# Altium project NANO_STM32F103.PrjPCB
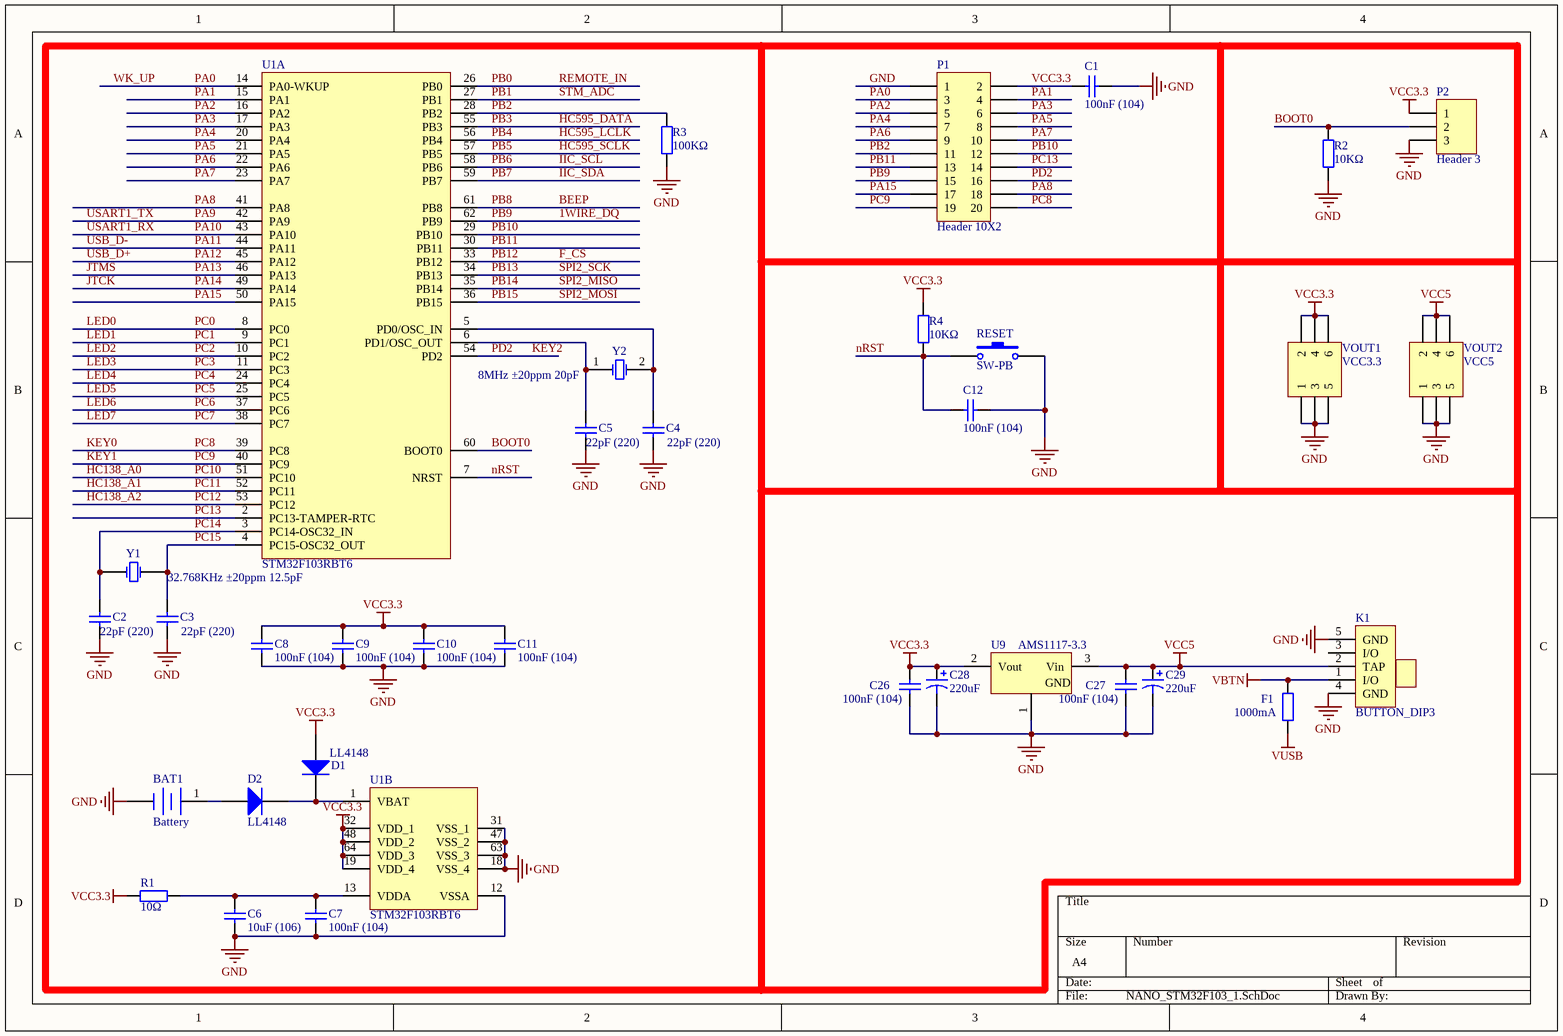
[diagram p0: NANO_STM32F103_1.SchDoc]
3 sheets, 129 parts. Net scope: global (net labels, ports and power ports of the same name join across sheets).
Board file: NANO_STM32F103.PcbDoc
Sheets:
  NANO_STM32F103_1.SchDoc
  NANO_STM32F103_2.SchDoc
  NANO_STM32F103_3.SchDoc

## Sheet NANO_STM32F103_1.SchDoc
size A4

### Parts
BAT1  Battery  [BAT-2]
C1  100nF (104)  [0603_C]
C2  22pF (220)  [0603_C]
C3  22pF (220)  [0603_C]
C4  22pF (220)  [0603_C]
C5  22pF (220)  [0603_C]
C6  10uF (106)  [0805_C]
C7  100nF (104)  [0603_C]
C8  100nF (104)  [0603_C]
C9  100nF (104)  [0603_C]
C10  100nF (104)  [0603_C]
C11  100nF (104)  [0603_C]
C12  100nF (104)  [0603_C]
C26  100nF (104)  [0603_C]
C27  100nF (104)  [0603_C]
C28  220uF  [RB7.6-15]
C29  220uF  [RB7.6-15]
D1  LL4148  [LL-34]
D2  LL4148  [LL-34]
F1  1000mA  [0805_R]
K1  BUTTON_DIP3  [SW]
P1  Header 10X2  [HDR2X10]
P2  Header 3  [HDR1X3]
R1  10Ω  [0603_R]
R2  10KΩ  [0603_R]
R3  100KΩ  [0603_R]
R4  10KΩ  [0603_R]
RESET  SW-PB  [SPST-2]
U1  STM32F103RBT6  [LQFP-64_10x10x05P]  (parts A,B of 2)
U9  AMS1117-3.3  [SOT-223]
VOUT1  VCC3.3  [HDR2X3]
VOUT2  VCC5  [HDR2X3]
Y1  32.768KHz ±20ppm 12.5pF  [SMD-3215_2P FC - 135]
Y2  8MHz ±20ppm 20pF  [SMD-5032_2P]

### Nets
GND: BAT1.2(-) C1.1 C2.2 C3.1 C4.1 C5.1 C6.2 C7.2 C8.1 C9.1 C10.1 C11.1 C12.1 C26.1 C27.1 C28.2 C29.2 K1.4(GND) K1.5(GND) P1.1 P2.3 R2.1 R3.1 RESET.2 U1.12(VSSA) U1.18(VSS_4) U1.31(VSS_1) U1.47(VSS_2) U1.63(VSS_3) U9.1(GND) VOUT1.1 VOUT1.3 VOUT1.5 VOUT2.1 VOUT2.3 VOUT2.5
VBTN: F1.2 K1.1(I/O)
VCC3.3: C1.2 C8.2 C9.2 C10.2 C11.2 C26.2 C28.1 D1.1(A) P1.2 P2.1 R1.1 R4.2 U1.19(VDD_4) U1.32(VDD_1) U1.48(VDD_2) U1.64(VDD_3) U9.2(Vout) VOUT1.2 VOUT1.4 VOUT1.6
VCC5: C27.2 C29.1 K1.2(TAP) U9.3(Vin) VOUT2.2 VOUT2.4 VOUT2.6
VUSB: F1.1
1WIRE_DQ: P1.15 U1.62(PB9)  [also labelled PB9]
BEEP: U1.61(PB8)  [also labelled PB8]
BOOT0: P2.2 R2.2 U1.60(BOOT0)
F_CS: U1.33(PB12)  [also labelled PB12]
HC138_A0: U1.51(PC10)  [also labelled PC10]
HC138_A1: U1.52(PC11)  [also labelled PC11]
HC138_A2: U1.53(PC12)  [also labelled PC12]
HC595_DATA: U1.55(PB3)  [also labelled PB3]
HC595_LCLK: U1.56(PB4)  [also labelled PB4]
HC595_SCLK: U1.57(PB5)  [also labelled PB5]
IIC_SCL: U1.58(PB6)  [also labelled PB6]
IIC_SDA: U1.59(PB7)  [also labelled PB7]
JTCK: U1.49(PA14)  [also labelled PA14]
JTMS: U1.46(PA13)  [also labelled PA13]
KEY0: P1.20 U1.39(PC8)  [also labelled PC8]
KEY1: P1.19 U1.40(PC9)  [also labelled PC9]
KEY2: P1.16 U1.54(PD2)  [also labelled PD2]
LED0: U1.8(PC0)  [also labelled PC0]
LED1: U1.9(PC1)  [also labelled PC1]
LED2: U1.10(PC2)  [also labelled PC2]
LED3: U1.11(PC3)  [also labelled PC3]
LED4: U1.24(PC4)  [also labelled PC4]
LED5: U1.25(PC5)  [also labelled PC5]
LED6: U1.37(PC6)  [also labelled PC6]
LED7: U1.38(PC7)  [also labelled PC7]
nRST: C12.2 R4.1 RESET.1 U1.7(NRST)
PA0: P1.3 U1.14(PA0-WKUP)  [also labelled WK_UP]
PA1: P1.4 U1.15(PA1)
PA2: P1.5 U1.16(PA2)
PA3: P1.6 U1.17(PA3)
PA4: P1.7 U1.20(PA4)
PA5: P1.8 U1.21(PA5)
PA6: P1.9 U1.22(PA6)
PA7: P1.10 U1.23(PA7)
PA8: P1.18 U1.41(PA8)
PA9: U1.42(PA9)  [also labelled USART1_TX]
PA10: U1.43(PA10)  [also labelled USART1_RX]
PA11: U1.44(PA11)  [also labelled USB_D-]
PA12: U1.45(PA12)  [also labelled USB_D+]
PA15: P1.17 U1.50(PA15)
PB0: U1.26(PB0)  [also labelled REMOTE_IN]
PB1: U1.27(PB1)  [also labelled STM_ADC]
PB2: P1.11 R3.2 U1.28(PB2)
PB10: P1.12 U1.29(PB10)
PB11: P1.13 U1.30(PB11)
PB13: U1.34(PB13)  [also labelled SPI2_SCK]
PB14: U1.35(PB14)  [also labelled SPI2_MISO]
PB15: U1.36(PB15)  [also labelled SPI2_MOSI]
PC13: P1.14 U1.2(PC13-TAMPER-RTC)
PC14: C2.1 U1.3(PC14-OSC32_IN) Y1.2(OSC2)
PC15: C3.2 U1.4(PC15-OSC32_OUT) Y1.1(OSC1)
NetBAT1_1: BAT1.1(+) D2.1(A)
NetC4_2: C4.2 U1.5(PD0/OSC_IN) Y2.2(OSC2)
NetC5_2: C5.2 U1.6(PD1/OSC_OUT) Y2.1(OSC1)
NetC6_1: C6.1 C7.1 R1.2 U1.13(VDDA)
NetD1_2: D1.2(K) D2.2(K) U1.1(VBAT)

Not connected (* = marked no-connect by the designer): K1 3(I/O)

### Library data of the parts
BAT1 = Battery: Multicell Battery; Published: 24-Mar-1999; LatestRevisionDate: 17-Jul-2002; LatestRevisionNote: Re-released for DXP Platform.; PackageReference: BAT-2; Publisher: Altium Limited; PackageDescription: Battery; 2 Leads
C1 C7-C12 C26 C27 = 0603 100nF (104) 10% 50V: 贴片电容; ComponentLink1Description: 供应商链接; ComponentLink1URL: http://www.szlcsc.com/product/details_15331.html; Package: 0603; Supplier: LC; SuppliersPartNumber: C14663
C2-C5 = 0603 22pF (220) 5% 50V: 贴片电容; ComponentLink1Description: 供应商链接; ComponentLink1URL: http://www.szlcsc.com/product/details_2005.html; Package: 0603; Supplier: LC; SuppliersPartNumber: C1653
C6 = 0805 10uF (106) 10% 25V: 贴片电容; ComponentLink1Description: 供应商链接; ComponentLink1URL: http://www.szlcsc.com/product/details_16532.html; Package: 0805; Supplier: LC; SuppliersPartNumber: C15850
C28 C29 = Cap Pol1: 电解电容; Value: 100pF; Published: 8-Jun-2000; LatestRevisionDate: 17-Jul-2002; LatestRevisionNote: Re-released for DXP Platform.; PackageReference: RB7.6-15; Publisher: Altium Limited; PackageDescription: Polarized Capacitor (Radial); 2 Leads
D1 D2 = LL-34 LL4148 LL-34 1206: 开关二极管; ComponentLink1Description: 供应商链接; ComponentLink1URL: http://www.szlcsc.com/product/details_10338.html; Package: LL-34; Supplier: LC; SuppliersPartNumber: C9808
F1 = 0805 1KΩ (1001) 1%: 自恢复保险丝; ComponentLink1Description: 供应商链接; ComponentLink1URL: http://www.szlcsc.com/product/details_18201.html; Package: 0805; Supplier: LC; SuppliersPartNumber: C17513
K1 = BUTTON_DIP3: 拨动开关
P1 = Header 10X2: Header, 10-Pin, Dual row; LatestRevisionDate: 17-Jul-2002; LatestRevisionNote: Re-released for DXP Platform.; Publisher: Altium Limited
P2 = Header 3: Header, 3-Pin; LatestRevisionDate: 17-Jul-2002; LatestRevisionNote: Re-released for DXP Platform.; Publisher: Altium Limited
R1 = 0603 10Ω (10R0) 1%: 贴片电阻; ComponentLink1Description: 供应商链接; ComponentLink1URL: http://www.szlcsc.com/product/details_23586.html; Package: 0603; Supplier: LC; SuppliersPartNumber: C22859
R2 R4 = 0603 10KΩ (1002) 1%: 贴片电阻; ComponentLink1Description: 供应商链接; ComponentLink1URL: http://www.szlcsc.com/product/details_26547.html; Package: 0603; Supplier: LC; SuppliersPartNumber: C25804
R3 = 0603 100KΩ (1003) 1%: 贴片电阻; ComponentLink1Description: 供应商链接; ComponentLink1URL: http://www.szlcsc.com/product/details_26546.html; Package: 0603; Supplier: LC; SuppliersPartNumber: C25803
RESET = SW-PB: RESET; Published: 24-Mar-1999; LatestRevisionDate: 17-Jul-2002; LatestRevisionNote: Re-released for DXP Platform.; PackageReference: SPST-2; Publisher: Altium Limited; PackageDescription: Switch; 2 Leads
U1 = STM32F103RBT6: ARM; ComponentLink1Description: 供应商链接; ComponentLink1URL: http://www.szlcsc.com/product/details_9244.html; Package: LQFP-64_10x10x05P; Supplier: LC; SuppliersPartNumber: C8735
U9 = SOT-223 AMS1117-3.3: 低压差线性稳压(LDO); ComponentLink1Description: 供应商链接; ComponentLink1URL: http://www.szlcsc.com/product/details_6652.html; Package: SOT-223; Supplier: LC; SuppliersPartNumber: C6186
VOUT1 VOUT2 = Header 3X2: Header, 3-Pin, Dual row; LatestRevisionDate: 17-Jul-2002; LatestRevisionNote: Re-released for DXP Platform.; Publisher: Altium Limited
Y1 = SMD-3215_2P 32.768KHz 20ppm 12.5pF: 贴片晶振; ComponentLink1Description: 供应商链接; ComponentLink1URL: http://www.szlcsc.com/product/details_33310.html; Package: SMD-3215_2P; Supplier: LC; SuppliersPartNumber: C32346
Y2 = SMD-5032_2P 8MHz 20ppm 20pF: 贴片晶振; ComponentLink1Description: 供应商链接; ComponentLink1URL: http://www.szlcsc.com/product/details_117214.html; Package: SMD-5032_2P; Supplier: LC; SuppliersPartNumber: C115962

## Sheet NANO_STM32F103_2.SchDoc
size A4
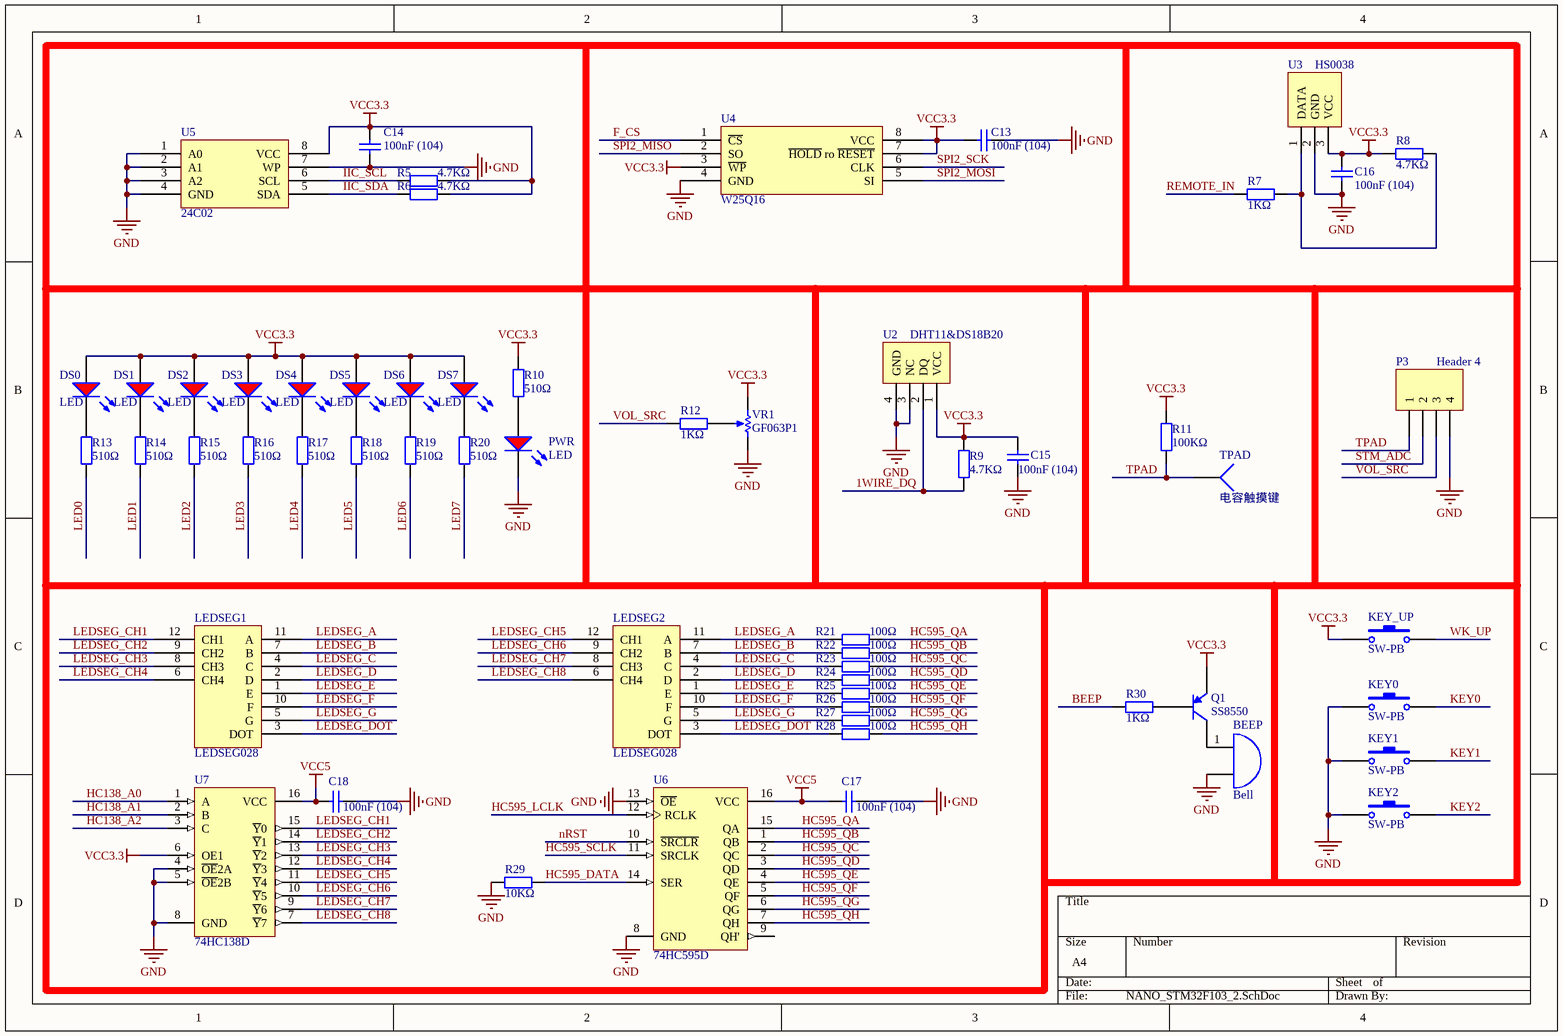
[diagram p1: NANO_STM32F103_2.SchDoc]

### Parts
BEEP  Bell  [PIN2]
C13  100nF (104)  [0603_C]
C14  100nF (104)  [0603_C]
C15  100nF (104)  [0603_C]
C16  100nF (104)  [0603_C]
C17  100nF (104)  [0603_C]
C18  100nF (104)  [0603_C]
DS0  LED  [0805_LED_S1]
DS1  LED  [0805_LED_S1]
DS2  LED  [0805_LED_S1]
DS3  LED  [0805_LED_S1]
DS4  LED  [0805_LED_S1]
DS5  LED  [0805_LED_S1]
DS6  LED  [0805_LED_S1]
DS7  LED  [0805_LED_S1]
KEY0  SW-PB  [SPST-2]
KEY1  SW-PB  [SPST-2]
KEY2  SW-PB  [SPST-2]
KEY_UP  SW-PB  [SPST-2]
LEDSEG1  LEDSEG028  [HDR1X12]
LEDSEG2  LEDSEG028  [HDR1X12]
P3  Header 4  [HDR1X4]
PWR  LED  [0805_LED_S1]
Q1  SS8550  [SOT-23(SOT-23-3)]
R5  4.7KΩ  [0603_R]
R6  4.7KΩ  [0603_R]
R7  1KΩ  [0603_R]
R8  4.7KΩ  [0603_R]
R9  4.7KΩ  [0603_R]
R10  510Ω  [0603_R]
R11  100KΩ  [0603_R]
R12  1KΩ  [0603_R]
R13  510Ω  [0603_R]
R14  510Ω  [0603_R]
R15  510Ω  [0603_R]
R16  510Ω  [0603_R]
R17  510Ω  [0603_R]
R18  510Ω  [0603_R]
R19  510Ω  [0603_R]
R20  510Ω  [0603_R]
R21  100Ω  [0603_R]
R22  100Ω  [0603_R]
R23  100Ω  [0603_R]
R24  100Ω  [0603_R]
R25  100Ω  [0603_R]
R26  100Ω  [0603_R]
R27  100Ω  [0603_R]
R28  100Ω  [0603_R]
R29  10KΩ  [0603_R]
R30  1KΩ  [0603_R]
TPAD  电容触摸键  [TPAD]
U2  DHT11&DS18B20  [DHT11&DS18B20]
U3  HS0038  [HS0038]
U4  W25Q16  [SOIC-8_208mil]
U5  24C02  [SOIC-8_150mil]
U6  74HC595D  [SOIC-16_150mil]
U7  74HC138D  [SOIC-16_150mil]
VR1  GF063P1  [VR5]

### Nets
GND: BEEP.2(B) C13.2 C14.1 C15.2 C16.2 C17.2 C18.2 KEY0.1 KEY1.1 KEY2.1 P3.4 PWR.K R29.1 U2.3(NC) U2.4(GND) U3.2(GND) U4.4(GND) U5.1(A0) U5.2(A1) U5.3(A2) U5.4(GND) U5.7(WP) U6.8(GND) U6.13(~{OE}) U7.4(~{OE}2A) U7.5(~{OE}2B) U7.8(GND) VR1.2(BOT)
VCC3.3: C13.1 C14.2 C15.1 C16.1 DS0.A DS1.A DS2.A DS3.A DS4.A DS5.A DS6.A DS7.A KEY_UP.1 Q1.2(E) R5.2 R6.2 R8.1 R9.2 R10.1 R11.1 U2.1(VCC) U3.3(VCC) U4.3(~{WP}) U4.7(~{HOLD}_ro_~{RESET}) U4.8(VCC) U5.8(VCC) U7.6(OE1) VR1.1(TOP)
VCC5: C17.1 C18.1 U6.16(VCC) U7.16(VCC)
1WIRE_DQ: R9.1 U2.2(DQ)
BEEP: R30.1
F_CS: U4.1(~{CS})
HC138_A0: U7.1(A)
HC138_A1: U7.2(B)
HC138_A2: U7.3(C)
HC595_DATA: R29.2 U6.14(SER)
HC595_LCLK: U6.12(RCLK)
HC595_QA: R21.2 U6.15(QA)
HC595_QB: R22.2 U6.1(QB)
HC595_QC: R23.2 U6.2(QC)
HC595_QD: R24.2 U6.3(QD)
HC595_QE: R25.2 U6.4(QE)
HC595_QF: R26.2 U6.5(QF)
HC595_QG: R27.2 U6.6(QG)
HC595_QH: R28.2 U6.7(QH)
HC595_SCLK: U6.11(SRCLK)
IIC_SCL: R5.1 U5.6(SCL)
IIC_SDA: R6.1 U5.5(SDA)
KEY0: KEY0.2
KEY1: KEY1.2
KEY2: KEY2.2
LED0: R13.2
LED1: R14.2
LED2: R15.2
LED3: R16.2
LED4: R17.2
LED5: R18.2
LED6: R19.2
LED7: R20.2
LEDSEG_A: LEDSEG1.11(A) LEDSEG2.11(A) R21.1
LEDSEG_B: LEDSEG1.7(B) LEDSEG2.7(B) R22.1
LEDSEG_C: LEDSEG1.4(C) LEDSEG2.4(C) R23.1
LEDSEG_CH1: LEDSEG1.12(CH1) U7.15(~{Y}0)
LEDSEG_CH2: LEDSEG1.9(CH2) U7.14(~{Y}1)
LEDSEG_CH3: LEDSEG1.8(CH3) U7.13(~{Y}2)
LEDSEG_CH4: LEDSEG1.6(CH4) U7.12(~{Y}3)
LEDSEG_CH5: LEDSEG2.12(CH1) U7.11(~{Y}4)
LEDSEG_CH6: LEDSEG2.9(CH2) U7.10(~{Y}5)
LEDSEG_CH7: LEDSEG2.8(CH3) U7.9(~{Y}6)
LEDSEG_CH8: LEDSEG2.6(CH4) U7.7(~{Y}7)
LEDSEG_D: LEDSEG1.2(D) LEDSEG2.2(D) R24.1
LEDSEG_DOT: LEDSEG1.3(DOT) LEDSEG2.3(DOT) R28.1
LEDSEG_E: LEDSEG1.1(E) LEDSEG2.1(E) R25.1
LEDSEG_F: LEDSEG1.10(F) LEDSEG2.10(F) R26.1
LEDSEG_G: LEDSEG1.5(G) LEDSEG2.5(G) R27.1
nRST: U6.10(~{SRCLR})
REMOTE_IN: R7.1  [project net PB0]
SPI2_MISO: U4.2(SO)  [project net PB14]
SPI2_MOSI: U4.5(SI)  [project net PB15]
SPI2_SCK: U4.6(CLK)  [project net PB13]
STM_ADC: P3.2  [project net PB1]
TPAD: P3.1 R11.2 TPAD.1
VOL_SRC: P3.3 R12.1
WK_UP: KEY_UP.2  [project net PA0]
NetBEEP_1: BEEP.1(A) Q1.3(C)
NetDS0_K: DS0.K R13.1
NetDS1_K: DS1.K R14.1
NetDS2_K: DS2.K R15.1
NetDS3_K: DS3.K R16.1
NetDS4_K: DS4.K R17.1
NetDS5_K: DS5.K R18.1
NetDS6_K: DS6.K R19.1
NetDS7_K: DS7.K R20.1
NetPWR_A: PWR.A R10.2
NetQ1_1: Q1.1(B) R30.2
NetR7_2: R7.2 R8.2 U3.1(DATA)
NetR12_2: R12.2 VR1.3(TAP)

Not connected (* = marked no-connect by the designer): U6 9(QH')

### Library data of the parts
BEEP = Bell: Electrical Bell; Published: 24-Mar-1999; LatestRevisionDate: 17-Jul-2002; LatestRevisionNote: Re-released for DXP Platform.; PackageReference: PIN2; Publisher: Altium Limited
C13-C18 = 0603 100nF (104) 10% 50V: 贴片电容; ComponentLink1Description: 供应商链接; ComponentLink1URL: http://www.szlcsc.com/product/details_15331.html; Package: 0603; Supplier: LC; SuppliersPartNumber: C14663
DS0-DS7 PWR = 0603 红灯: 发光二极管; ComponentLink1Description: 供应商链接; ComponentLink1URL: http://www.szlcsc.com/product/details_2659.html; Package: 0603; Supplier: LC; SuppliersPartNumber: C2286
KEY0-KEY2 KEY_UP = SW-PB: Switch; Published: 24-Mar-1999; LatestRevisionDate: 17-Jul-2002; LatestRevisionNote: Re-released for DXP Platform.; PackageReference: SPST-2; Publisher: Altium Limited; PackageDescription: Switch; 2 Leads
LEDSEG1 LEDSEG2 = LEDSEG028: 四位八段数码管_共阴极
P3 = Header 4: Header, 4-Pin; LatestRevisionDate: 17-Jul-2002; LatestRevisionNote: Re-released for DXP Platform.; Publisher: Altium Limited
Q1 = SOT-23 SS8550 Y2: PNP三极管; ComponentLink1Description: 供应商链接; ComponentLink1URL: http://www.szlcsc.com/product/details_9037.html; Package: SOT-23; Supplier: LC; SuppliersPartNumber: C8542
R5 R6 R8 R9 = 0603 4.7KΩ (4701) 1%: 贴片电阻; ComponentLink1Description: 供应商链接; ComponentLink1URL: http://www.szlcsc.com/product/details_23889.html; Package: 0603; Supplier: LC; SuppliersPartNumber: C23162
R7 R12 R30 = 0603 1KΩ (1001) 1%: 贴片电阻; ComponentLink1Description: 供应商链接; ComponentLink1URL: http://www.szlcsc.com/product/details_21904.html; Package: 0603; Supplier: LC; SuppliersPartNumber: C21190
R10 R13-R20 = 0603 510Ω (5100) 1%: 贴片电阻; ComponentLink1Description: 供应商链接; ComponentLink1URL: http://www.szlcsc.com/product/details_23920.html; Package: 0603; Supplier: LC; SuppliersPartNumber: C23193
R11 = 0603 100KΩ (1003) 1%: 贴片电阻; ComponentLink1Description: 供应商链接; ComponentLink1URL: http://www.szlcsc.com/product/details_26546.html; Package: 0603; Supplier: LC; SuppliersPartNumber: C25803
R21-R28 = 0603 100Ω (1000) 1%: 贴片电阻; ComponentLink1Description: 供应商链接; ComponentLink1URL: http://www.szlcsc.com/product/details_23502.html; Package: 0603; Supplier: LC; SuppliersPartNumber: C22775
R29 = 0603 10KΩ (1002) 1%: 贴片电阻; ComponentLink1Description: 供应商链接; ComponentLink1URL: http://www.szlcsc.com/product/details_26547.html; Package: 0603; Supplier: LC; SuppliersPartNumber: C25804
TPAD = Socket: LatestRevisionDate: 17-Jul-2002; LatestRevisionNote: Re-released for DXP Platform.; Publisher: Altium Limited
U2 = DHT11&DS18B20: DHT11或DS18B20_2.54mm
U3 = HS0038: HS0038_2.54mm
U4 = W25Q128FVSIG_[C35101]: Flash ROM; ComponentLink1Description: 供应商链接; ComponentLink1URL: http://www.szlcsc.com/product/details_36072.html; Package: SOIC-8; Supplier: LC; SuppliersPartNumber: C35101
U5 = CAN/TJA1050T/CM_[C6952]: ComponentLink1Description: 供应商链接; ComponentLink1URL: http://www.szlcsc.com/product/details_7424.html; Package: SOIC-8_150mil; Supplier: LC; SuppliersPartNumber: C6952
U6 = 74HC595D_[C5947]: 74系列逻辑芯片; ComponentLink1Description: 供应商链接; ComponentLink1URL: http://www.szlcsc.com/product/details_6413.html; Package: SOIC-16_150mil; Supplier: LC; SuppliersPartNumber: C5947
U7 = 74HC138D_[C5602]: 74系列逻辑芯片; ComponentLink1Description: 供应商链接; ComponentLink1URL: http://www.szlcsc.com/product/details_6053.html; Package: SOIC-16_150mil; Supplier: LC; SuppliersPartNumber: C5602
VR1 = RPot: 滑动变阻器; Sim Note: Enter the Resistance value and the set point into parameter fields.; Set Position: 0.5; Value: 1K; Published: 8-Jun-2000; LatestRevisionDate: 17-Jul-2002; LatestRevisionNote: Re-released for DXP Platform.; PackageReference: VR5; Publisher: Altium Limited; PackageDescription: Variable Resistor, Thru-Hole; 3 Leads

## Sheet NANO_STM32F103_3.SchDoc
size A4
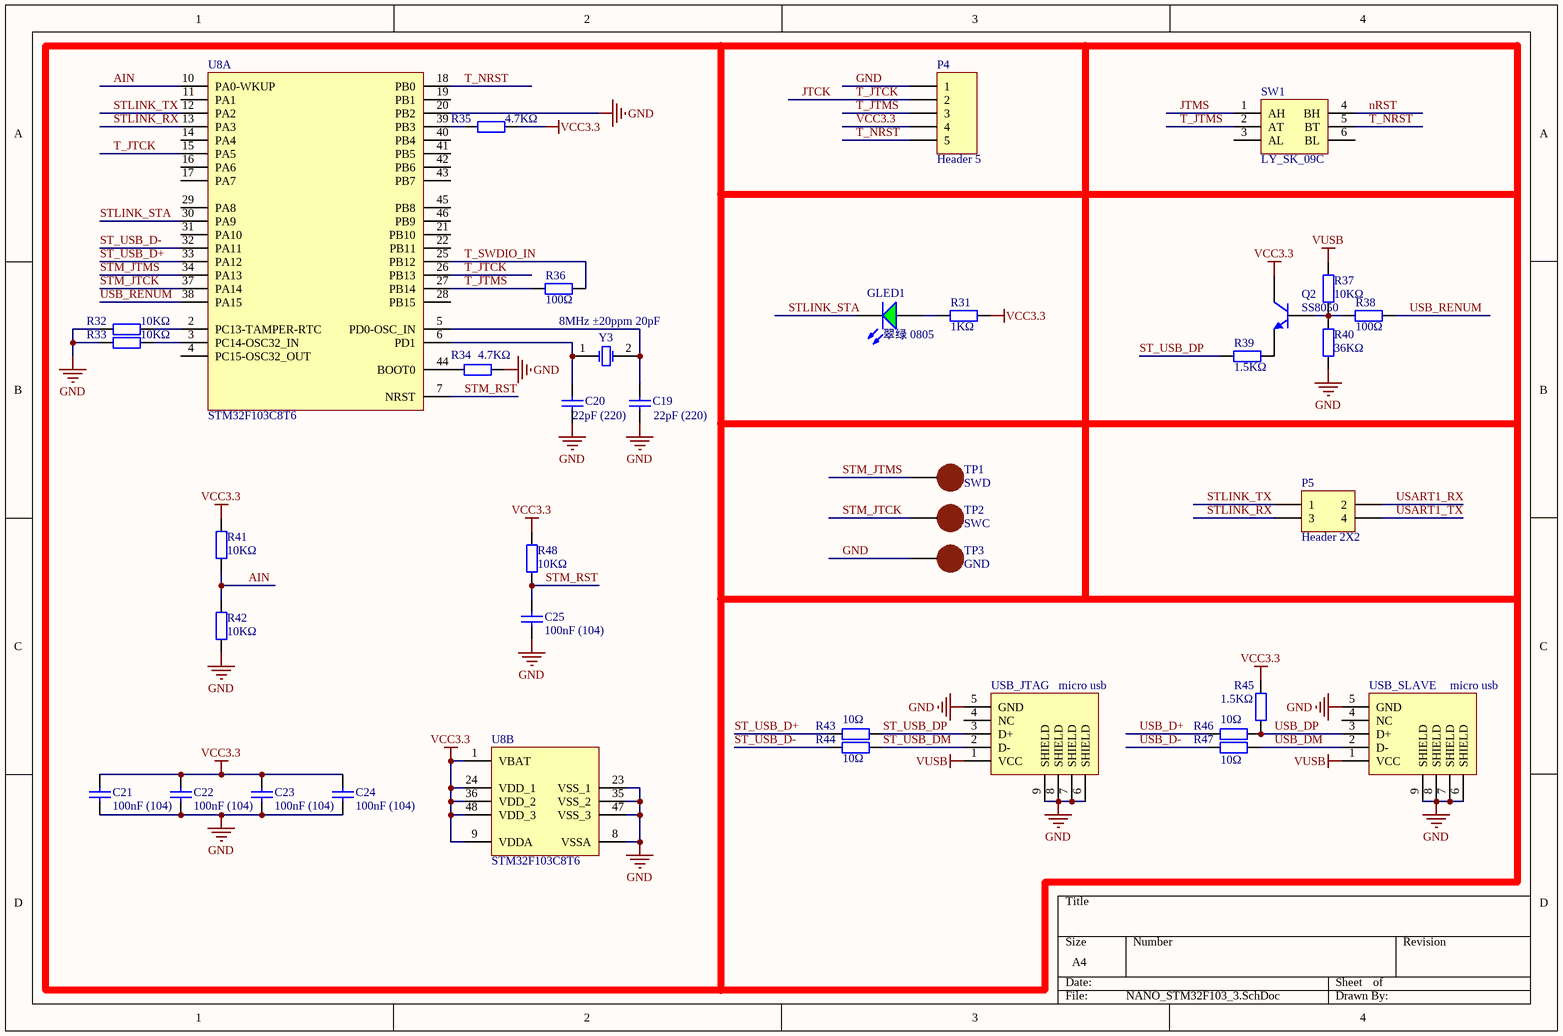
[diagram p2: NANO_STM32F103_3.SchDoc]

### Parts
C19  22pF (220)  [0603_C]
C20  22pF (220)  [0603_C]
C21  100nF (104)  [0603_C]
C22  100nF (104)  [0603_C]
C23  100nF (104)  [0603_C]
C24  100nF (104)  [0603_C]
C25  100nF (104)  [0603_C]
GLED1  翠绿 0805  [0805_LED_S1]
P4  Header 5  [HDR1X5]
P5  Header 2X2  [HDR2X2]
Q2  SS8050  [SOT-23(SOT-23-3)]
R31  1KΩ  [0603_R]
R32  10KΩ  [0603_R]
R33  10KΩ  [0603_R]
R34  4.7KΩ  [0603_R]
R35  4.7KΩ  [0603_R]
R36  100Ω  [0603_R]
R37  10KΩ  [0603_R]
R38  100Ω  [0603_R]
R39  1.5KΩ  [0603_R]
R40  36KΩ  [0603_R]
R41  10KΩ  [0603_R]
R42  10KΩ  [0603_R]
R43  10Ω  [0603_R]
R44  10Ω  [0603_R]
R45  1.5KΩ  [0603_R]
R46  10Ω  [0603_R]
R47  10Ω  [0603_R]
R48  10KΩ  [0603_R]
SW1  LY_SK_09C  [HDR2X3_CEN]
TP1  SWD  [PIN1]
TP2  SWC  [PIN1]
TP3  GND  [PIN1]
U8  STM32F103C8T6  [LQFP-48_7x7x05P]  (parts A,B of 2)
USB_JTAG  micro usb  [USB_Micro]
USB_SLAVE  micro usb  [USB_Micro]
Y3  8MHz ±20ppm 20pF  [SMD-5032_2P]

### Nets
GND: C19.1 C20.1 C21.2 C22.2 C23.2 C24.2 C25.2 P4.1 R32.1 R33.1 R34.2 R40.1 R42.1 TP3.1 U8.8(VSSA) U8.20(PB2) U8.23(VSS_1) U8.35(VSS_2) U8.47(VSS_3) USB_JTAG.5(GND) USB_JTAG.6(SHIELD) USB_JTAG.7(SHIELD) USB_JTAG.8(SHIELD) USB_JTAG.9(SHIELD) USB_SLAVE.5(GND) USB_SLAVE.6(SHIELD) USB_SLAVE.7(SHIELD) USB_SLAVE.8(SHIELD) USB_SLAVE.9(SHIELD)
VCC3.3: C21.1 C22.1 C23.1 C24.1 P4.4 Q2.3(C) R31.2 R35.2 R41.2 R45.2 R48.2 U8.1(VBAT) U8.9(VDDA) U8.24(VDD_1) U8.36(VDD_2) U8.48(VDD_3)
VUSB: R37.2 USB_JTAG.1(VCC) USB_SLAVE.1(VCC)
AIN: R41.1 R42.2 U8.10(PA0-WKUP)
JTCK: P4.2 U8.15(PA5) U8.26(PB13)  [also labelled T_JTCK]
JTMS: SW1.1(AH)
nRST: SW1.4(BH)
ST_USB_D+: R43.1 U8.33(PA12)
ST_USB_D-: R44.1 U8.32(PA11)
ST_USB_DM: R44.2 USB_JTAG.2(D-)
ST_USB_DP: R39.1 R43.2 USB_JTAG.3(D+)
STLINK_RX: P5.3 U8.13(PA3)
STLINK_STA: GLED1.K U8.30(PA9)
STLINK_TX: P5.1 U8.12(PA2)
STM_JTCK: TP2.1 U8.37(PA14)
STM_JTMS: TP1.1 U8.34(PA13)
STM_RST: C25.1 R48.1 U8.7(NRST)
T_JTMS: P4.3 R36.1 SW1.2(AT) U8.27(PB14)
T_NRST: P4.5 SW1.5(BT) U8.18(PB0)
T_SWDIO_IN: R36.2 U8.25(PB12)
USART1_RX: P5.2  [project net PA10]
USART1_TX: P5.4  [project net PA9]
USB_D+: R46.1  [project net PA12]
USB_D-: R47.1  [project net PA11]
USB_DM: R47.2 USB_SLAVE.2(D-)
USB_DP: R45.1 R46.2 USB_SLAVE.3(D+)
USB_RENUM: R38.2 U8.38(PA15)
NetC19_2: C19.2 U8.5(PD0-OSC_IN) Y3.2(OSC2)
NetC20_2: C20.2 U8.6(PD1) Y3.1(OSC1)
NetGLED1_A: GLED1.A R31.1
NetQ2_1: Q2.1(B) R37.1 R38.1 R40.2
NetQ2_2: Q2.2(E) R39.2
NetR32_2: R32.2 U8.2(PC13-TAMPER-RTC)
NetR33_2: R33.2 U8.3(PC14-OSC32_IN)
NetR34_1: R34.1 U8.44(BOOT0)
NetR35_1: R35.1 U8.39(PB3)

Not connected (* = marked no-connect by the designer): SW1 3(AL) 6(BL); U8 4(PC15-OSC32_OUT) 11(PA1) 14(PA4) 16(PA6) 17(PA7) 19(PB1) 21(PB10) 22(PB11) 28(PB15) 29(PA8) 31(PA10) 40(PB4) 41(PB5) 42(PB6) 43(PB7) 45(PB8) 46(PB9); USB_JTAG 4(NC); USB_SLAVE 4(NC)

### Library data of the parts
C19 C20 = 0603 22pF (220) 5% 50V: 贴片电容; ComponentLink1Description: 供应商链接; ComponentLink1URL: http://www.szlcsc.com/product/details_2005.html; Package: 0603; Supplier: LC; SuppliersPartNumber: C1653
C21-C25 = 0603 100nF (104) 10% 50V: 贴片电容; ComponentLink1Description: 供应商链接; ComponentLink1URL: http://www.szlcsc.com/product/details_15331.html; Package: 0603; Supplier: LC; SuppliersPartNumber: C14663
GLED1 = 0805 翠绿: 发光二极管; ComponentLink1Description: 供应商链接; ComponentLink1URL: http://www.szlcsc.com/product/details_2670.html; Package: 0805; Supplier: LC; SuppliersPartNumber: C2297
P4 = Header 5: Header, 5-Pin; LatestRevisionDate: 17-Jul-2002; LatestRevisionNote: Re-released for DXP Platform.; Publisher: Altium Limited
P5 = Header 2X2: Header, 2-Pin, Dual row; LatestRevisionDate: 17-Jul-2002; LatestRevisionNote: Re-released for DXP Platform.; Publisher: Altium Limited
Q2 = SOT-23 SS8050 Y1: NPN三极管; ComponentLink1Description: 供应商链接; ComponentLink1URL: http://www.szlcsc.com/product/details_2507.html; Package: SOT-23; Supplier: LC; SuppliersPartNumber: C2150
R31 = 0603 1KΩ (1001) 1%: 贴片电阻; ComponentLink1Description: 供应商链接; ComponentLink1URL: http://www.szlcsc.com/product/details_21904.html; Package: 0603; Supplier: LC; SuppliersPartNumber: C21190
R32 R33 R37 R41 R42 R48 = 0603 10KΩ (1002) 1%: 贴片电阻; ComponentLink1Description: 供应商链接; ComponentLink1URL: http://www.szlcsc.com/product/details_26547.html; Package: 0603; Supplier: LC; SuppliersPartNumber: C25804
R34 R35 = 0603 4.7KΩ (4701) 1%: 贴片电阻; ComponentLink1Description: 供应商链接; ComponentLink1URL: http://www.szlcsc.com/product/details_23889.html; Package: 0603; Supplier: LC; SuppliersPartNumber: C23162
R36 R38 = 0603 100Ω (1000) 1%: 贴片电阻; ComponentLink1Description: 供应商链接; ComponentLink1URL: http://www.szlcsc.com/product/details_23502.html; Package: 0603; Supplier: LC; SuppliersPartNumber: C22775
R39 R45 = 0603 1.5KΩ (1501) 1%: 贴片电阻; ComponentLink1Description: 供应商链接; ComponentLink1URL: http://www.szlcsc.com/product/details_23570.html; Package: 0603; Supplier: LC; SuppliersPartNumber: C22843
R40 = 0603 36KΩ (3602) 1%: 贴片电阻; ComponentLink1Description: 供应商链接; ComponentLink1URL: http://www.szlcsc.com/product/details_23874.html; Package: 0603; Supplier: LC; SuppliersPartNumber: C23147
R43 R44 R46 R47 = 0603 10Ω (10R0) 1%: 贴片电阻; ComponentLink1Description: 供应商链接; ComponentLink1URL: http://www.szlcsc.com/product/details_23586.html; Package: 0603; Supplier: LC; SuppliersPartNumber: C22859
SW1 = Switch_1
TP1-TP3 = PAN: 圆形焊盘
U8 = STM32F103C8T6: ARM; ComponentLink1Description: 供应商链接; ComponentLink1URL: http://www.szlcsc.com/product/details_9243.html; Package: LQFP-48_7x7x05P; Supplier: LC; SuppliersPartNumber: C8734
USB_JTAG USB_SLAVE = USB_1
Y3 = SMD-5032_2P 8MHz 20ppm 20pF: 贴片晶振; ComponentLink1Description: 供应商链接; ComponentLink1URL: http://www.szlcsc.com/product/details_117214.html; Package: SMD-5032_2P; Supplier: LC; SuppliersPartNumber: C115962

## Nets that join several sheets
GND: NANO_STM32F103_1 (36 pins), NANO_STM32F103_2 (28 pins), NANO_STM32F103_3 (29 pins)
VCC3.3: NANO_STM32F103_1 (20 pins), NANO_STM32F103_2 (28 pins), NANO_STM32F103_3 (16 pins)
VCC5: NANO_STM32F103_1 (7 pins), NANO_STM32F103_2 (C17.1 C18.1 U6.16 U7.16)
VUSB: NANO_STM32F103_1 (F1.1), NANO_STM32F103_3 (R37.2 USB_JTAG.1 USB_SLAVE.1)
1WIRE_DQ: NANO_STM32F103_1 (P1.15 U1.62), NANO_STM32F103_2 (R9.1 U2.2)
BEEP: NANO_STM32F103_1 (U1.61), NANO_STM32F103_2 (R30.1)
F_CS: NANO_STM32F103_1 (U1.33), NANO_STM32F103_2 (U4.1)
HC138_A0: NANO_STM32F103_1 (U1.51), NANO_STM32F103_2 (U7.1)
HC138_A1: NANO_STM32F103_1 (U1.52), NANO_STM32F103_2 (U7.2)
HC138_A2: NANO_STM32F103_1 (U1.53), NANO_STM32F103_2 (U7.3)
HC595_DATA: NANO_STM32F103_1 (U1.55), NANO_STM32F103_2 (R29.2 U6.14)
HC595_LCLK: NANO_STM32F103_1 (U1.56), NANO_STM32F103_2 (U6.12)
HC595_SCLK: NANO_STM32F103_1 (U1.57), NANO_STM32F103_2 (U6.11)
IIC_SCL: NANO_STM32F103_1 (U1.58), NANO_STM32F103_2 (R5.1 U5.6)
IIC_SDA: NANO_STM32F103_1 (U1.59), NANO_STM32F103_2 (R6.1 U5.5)
JTCK: NANO_STM32F103_1 (U1.49), NANO_STM32F103_3 (P4.2 U8.15 U8.26)
JTMS: NANO_STM32F103_1 (U1.46), NANO_STM32F103_3 (SW1.1)
KEY0: NANO_STM32F103_1 (P1.20 U1.39), NANO_STM32F103_2 (KEY0.2)
KEY1: NANO_STM32F103_1 (P1.19 U1.40), NANO_STM32F103_2 (KEY1.2)
KEY2: NANO_STM32F103_1 (P1.16 U1.54), NANO_STM32F103_2 (KEY2.2)
LED0: NANO_STM32F103_1 (U1.8), NANO_STM32F103_2 (R13.2)
LED1: NANO_STM32F103_1 (U1.9), NANO_STM32F103_2 (R14.2)
LED2: NANO_STM32F103_1 (U1.10), NANO_STM32F103_2 (R15.2)
LED3: NANO_STM32F103_1 (U1.11), NANO_STM32F103_2 (R16.2)
LED4: NANO_STM32F103_1 (U1.24), NANO_STM32F103_2 (R17.2)
LED5: NANO_STM32F103_1 (U1.25), NANO_STM32F103_2 (R18.2)
LED6: NANO_STM32F103_1 (U1.37), NANO_STM32F103_2 (R19.2)
LED7: NANO_STM32F103_1 (U1.38), NANO_STM32F103_2 (R20.2)
nRST: NANO_STM32F103_1 (C12.2 R4.1 RESET.1 U1.7), NANO_STM32F103_2 (U6.10), NANO_STM32F103_3 (SW1.4)
PA0: NANO_STM32F103_1 (P1.3 U1.14), NANO_STM32F103_2 (KEY_UP.2)
PA9: NANO_STM32F103_1 (U1.42), NANO_STM32F103_3 (P5.4)
PA10: NANO_STM32F103_1 (U1.43), NANO_STM32F103_3 (P5.2)
PA11: NANO_STM32F103_1 (U1.44), NANO_STM32F103_3 (R47.1)
PA12: NANO_STM32F103_1 (U1.45), NANO_STM32F103_3 (R46.1)
PB0: NANO_STM32F103_1 (U1.26), NANO_STM32F103_2 (R7.1)
PB1: NANO_STM32F103_1 (U1.27), NANO_STM32F103_2 (P3.2)
PB13: NANO_STM32F103_1 (U1.34), NANO_STM32F103_2 (U4.6)
PB14: NANO_STM32F103_1 (U1.35), NANO_STM32F103_2 (U4.2)
PB15: NANO_STM32F103_1 (U1.36), NANO_STM32F103_2 (U4.5)